# EAGLE board DIY_Keyboard_V1.1 (EAGLE 9.4.2)
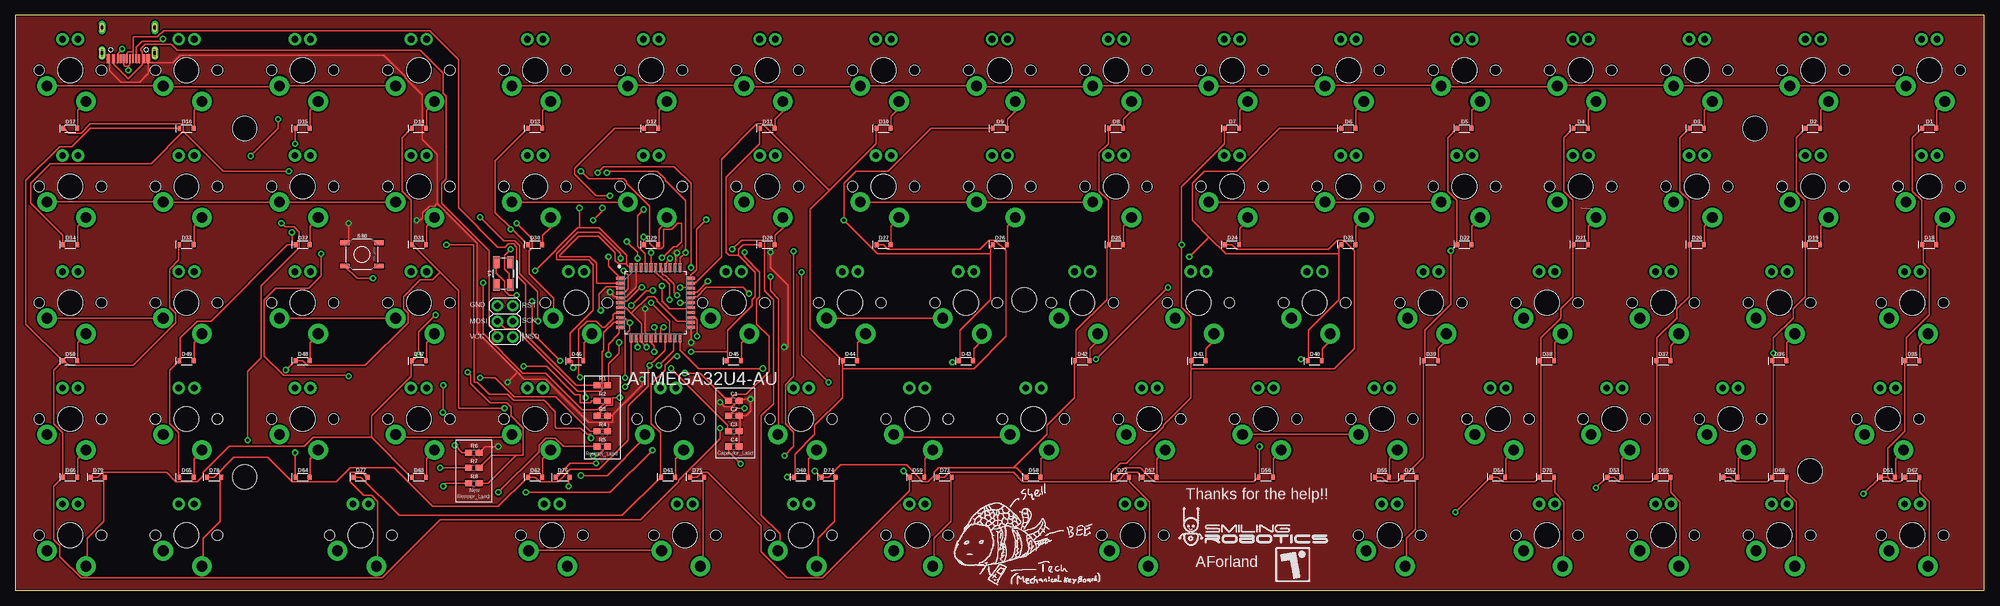
[diagram p2: board, top side]
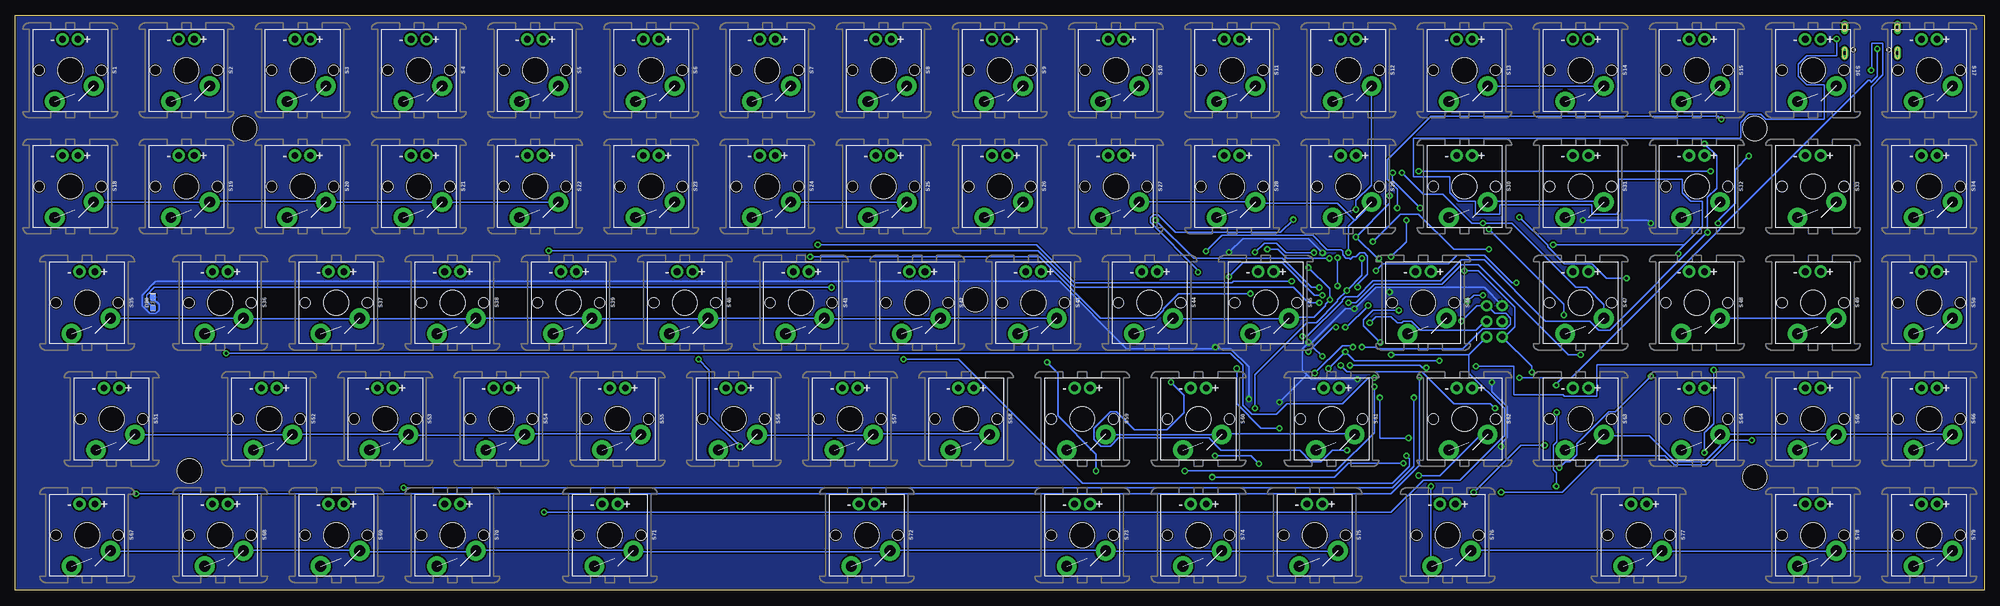
[diagram p3: board, bottom side, seen from below]

Size 322 x 94 mm. Coordinates in mm from the lower left corner, seen from the top.
Outline: 0,0 322,0 322,94 0,94 0,0
Copper layers (1*16): Top 0.035mm / dielectric 1.5mm / Bottom 0.035mm
Design rules "SparkFun-2-layer-STANDARD *": minimum track width 10mil, minimum drill 20mil, track to track 10mil, track to pad 6mil, pad to pad 6mil, via to via 10mil, smd to smd 8mil, copper to edge 8mil, drill to drill 8mil, minimum pad ring 10mil, minimum via ring 10mil, stop-mask expansion 4mil, vias tented up to drill 20mil, thermal gap 10mil
Holes 4 mm at 37.5,75.5 37.5,18.5 293.5,19.5 284.5,75.5 165,47.5

## Footprints (pad centres in the part's own frame; a part is rotated, then mirrored left to right if it is on the bottom)
QFP80P1200X1200X120-44N = smd 1.473 x 0.508: 1 -5.74,3.988; 2 -5.74,3.2; 3 -5.74,2.388; 4 -5.74,1.6; 5 -5.74,0.787; 6 -5.74,0; 7 -5.74,-0.787; 8 -5.74,-1.6; 9 -5.74,-2.388; 10 -5.74,-3.2; 11 -5.74,-3.988; 23 5.74,-3.988; 24 5.74,-3.2; 25 5.74,-2.388; 26 5.74,-1.6; 27 5.74,-0.787; 28 5.74,0; 29 5.74,0.787; 30 5.74,1.6; 31 5.74,2.388; 32 5.74,3.2; 33 5.74,3.988 | smd 0.508 x 1.473: 12 -3.988,-5.74; 13 -3.2,-5.74; 14 -2.388,-5.74; 15 -1.6,-5.74; 16 -0.787,-5.74; 17 0,-5.74; 18 0.787,-5.74; 19 1.6,-5.74; 20 2.388,-5.74; 21 3.2,-5.74; 22 3.988,-5.74; 34 3.988,5.74; 35 3.2,5.74; 36 2.388,5.74; 37 1.6,5.74; 38 0.787,5.74; 39 0,5.74; 40 -0.787,5.74; 41 -1.6,5.74; 42 -2.388,5.74; 43 -3.2,5.74; 44 -3.988,5.74
0603 = smd 1.1 x 1: 1 -0.85,0; 2 0.85,0
SOD-323 = smd 0.63 x 0.83: A 1.15,0; C -1.15,0
LED-0603 = smd 1 x 1: A -0.877,0; C 0.877,0
2X3 = drill 1.016 pad 1.88: 1 0,0; 2 0,2.54; 3 2.54,0; 4 2.54,2.54; 5 5.08,0; 6 5.08,2.54
CHERRY-MX-LED = drill 1.092 pad 2.032: A -1.27,-5.08; K 1.27,-5.08 | drill 1.753 pad 3.226: S1 -3.81,2.54; S2 2.54,5.08 | hole 4.089: 0,0 | hole 1.707: -5.08,0; 5.08,0
TACTILE_SWITCH_SMD_5.2MM = smd 1.524 x 0.762: 1 -2.794,1.905; 2 2.794,1.905; 3 -2.794,-1.905; 4 2.794,-1.905
USB_TYPE_C = smd 0.6 x 1.45: A1B12GND -3.25,5.095; A4B9VBUS -2.45,5.095; A9B4VBUS 2.45,5.095; A12B1GND 3.25,5.095 | smd 0.3 x 1.45: A5 -1.25,5.095; A6 -0.25,5.095; A7 0.25,5.095; A8 1.25,5.095; B5 1.75,5.095; B6 0.75,5.095; B7 -0.75,5.095; B8 -1.75,5.095 | drill 0.6 long: P$1 -4.32,0; P$2 4.32,0 | drill 0.6 pad 1 long: P$3 -4.32,4.18; P$4 4.32,4.18 | hole 0.65: -2.89,3.65; 2.89,3.65
CRYSTAL-SMD-5X3.2-4PAD = smd 1.9 x 1.1: 1 -1.85,-1.15; 2 1.85,-1.15; 3 1.85,1.15; 4 -1.85,1.15

## Placement (x,y rotation side)
ATMEGA32U4-AU  ATMEGA32U4-AU  [QFP80P1200X1200X120-44N]  104.73,47 0 top
C1  1.0uF  [0603]  117.5,31 0 top
C2  10pF  [0603]  117.5,28.5 0 top
C3  10pF  [0603]  117.5,26 0 top
C4  1.0uF  [0603]  117.5,23.5 0 top
D1  250mA/100V  [SOD-323]  313,75.5 0 top
D2  250mA/100V  [SOD-323]  294,75.5 0 top
D3  250mA/100V  [SOD-323]  275,75.5 0 top
D4  250mA/100V  [SOD-323]  256,75.5 0 top
D5  250mA/100V  [SOD-323]  237,75.5 0 top
D6  250mA/100V  [SOD-323]  218,75.5 0 top
D7  250mA/100V  [SOD-323]  199,75.5 0 top
D8  250mA/100V  [SOD-323]  180,75.5 0 top
D9  250mA/100V  [SOD-323]  161,75.5 0 top
D10  250mA/100V  [SOD-323]  142,75.5 0 top
D11  250mA/100V  [SOD-323]  123,75.5 0 top
D12  250mA/100V  [SOD-323]  104,75.5 0 top
D13  250mA/100V  [SOD-323]  85,75.5 0 top
D14  250mA/100V  [SOD-323]  66,75.5 0 top
D15  250mA/100V  [SOD-323]  47,75.5 0 top
D16  250mA/100V  [SOD-323]  28,75.5 0 top
D17  250mA/100V  [SOD-323]  9,75.5 0 top
D18  250mA/100V  [SOD-323]  313,56.5 0 top
D19  250mA/100V  [SOD-323]  294,56.5 0 top
D20  250mA/100V  [SOD-323]  275,56.5 0 top
D21  250mA/100V  [SOD-323]  256,56.5 0 top
D22  250mA/100V  [SOD-323]  237,56.5 0 top
D23  250mA/100V  [SOD-323]  218,56.5 0 top
D24  250mA/100V  [SOD-323]  199,56.5 0 top
D25  250mA/100V  [SOD-323]  180,56.5 0 top
D26  250mA/100V  [SOD-323]  161,56.5 0 top
D27  250mA/100V  [SOD-323]  142,56.5 0 top
D28  250mA/100V  [SOD-323]  123,56.5 0 top
D29  250mA/100V  [SOD-323]  104,56.5 0 top
D30  250mA/100V  [SOD-323]  85,56.5 0 top
D31  250mA/100V  [SOD-323]  66,56.5 0 top
D32  250mA/100V  [SOD-323]  47,56.5 0 top
D33  250mA/100V  [SOD-323]  28,56.5 0 top
D34  250mA/100V  [SOD-323]  9,56.5 0 top
D35  250mA/100V  [SOD-323]  310.25,37.5 0 top
D36  250mA/100V  [SOD-323]  288.5,37.5 0 top
D37  250mA/100V  [SOD-323]  269.5,37.5 0 top
D38  250mA/100V  [SOD-323]  250.5,37.5 0 top
D39  250mA/100V  [SOD-323]  231.5,37.5 0 top
D40  250mA/100V  [SOD-323]  212.5,37.5 0 top
D41  250mA/100V  [SOD-323]  193.5,37.5 0 top
D42  250mA/100V  [SOD-323]  174.5,37.5 0 top
D43  250mA/100V  [SOD-323]  155.5,37.5 0 top
D44  250mA/100V  [SOD-323]  136.5,37.5 0 top
D45  250mA/100V  [SOD-323]  117.5,37.5 0 top
D46  250mA/100V  [SOD-323]  91.75,37.5 0 top
D47  250mA/100V  [SOD-323]  66,37.5 0 top
D48  250mA/100V  [SOD-323]  47,37.5 0 top
D49  250mA/100V  [SOD-323]  28,37.5 0 top
D50  250mA/100V  [SOD-323]  9,37.5 0 top
D51  250mA/100V  [SOD-323]  306.25,18.5 0 top
D52  250mA/100V  [SOD-323]  280.5,18.5 0 top
D53  250mA/100V  [SOD-323]  261.5,18.5 0 top
D54  250mA/100V  [SOD-323]  242.5,18.5 0 top
D55  250mA/100V  [SOD-323]  223.5,18.5 0 top
D56  250mA/100V  [SOD-323]  204.5,18.5 0 top
D57  250mA/100V  [SOD-323]  185.5,18.5 0 top
D58  250mA/100V  [SOD-323]  166.5,18.5 0 top
D59  250mA/100V  [SOD-323]  147.5,18.5 0 top
D60  250mA/100V  [SOD-323]  128.5,18.5 0 top
D61  250mA/100V  [SOD-323]  106.75,18.5 0 top
D62  250mA/100V  [SOD-323]  85,18.5 0 top
D63  250mA/100V  [SOD-323]  66,18.5 0 top
D64  250mA/100V  [SOD-323]  47,18.5 0 top
D65  250mA/100V  [SOD-323]  28,18.5 0 top
D66  250mA/100V  [SOD-323]  9,18.5 0 top
D67  250mA/100V  [SOD-323]  310.25,18.5 0 top
D68  250mA/100V  [SOD-323]  288.5,18.5 0 top
D69  250mA/100V  [SOD-323]  269.5,18.5 0 top
D70  250mA/100V  [SOD-323]  250.5,18.5 0 top
D71  250mA/100V  [SOD-323]  228,18.5 0 top
D72  250mA/100V  [SOD-323]  181,18.5 0 top
D73  250mA/100V  [SOD-323]  152,18.5 0 top
D74  250mA/100V  [SOD-323]  133,18.5 0 top
D75  250mA/100V  [SOD-323]  111.5,18.5 0 top
D76  250mA/100V  [SOD-323]  89.5,18.5 0 top
D77  250mA/100V  [SOD-323]  56.5,18.5 0 top
D78  250mA/100V  [SOD-323]  32.5,18.5 0 top
D79  250mA/100V  [SOD-323]  13.5,18.5 0 top
D80  WHITE  [LED-0603]  299.5,47 90 bottom
ISP  [2X3]  81.39,41.43 90 top
R1  22  [0603]  96,33.5 0 top
R2  22  [0603]  96,31 0 top
R3  5.1k  [0603]  96,28.5 0 top
R4  5.1k  [0603]  96,26 0 top
R5  22  [0603]  96,23.5 0 top
R6  1k  [0603]  75,22.5 0 top
R7  56k  [0603]  75,20 0 top
R8  56k  [0603]  75,17.5 0 top
S1  MOMENTARY-SWITCH-SPST-LED-PTH-CHERRY  [CHERRY-MX-LED]  313,85 180 bottom
S2  MOMENTARY-SWITCH-SPST-LED-PTH-CHERRY  [CHERRY-MX-LED]  294,85 180 bottom
S3  MOMENTARY-SWITCH-SPST-LED-PTH-CHERRY  [CHERRY-MX-LED]  275,85 180 bottom
S4  MOMENTARY-SWITCH-SPST-LED-PTH-CHERRY  [CHERRY-MX-LED]  256,85 180 bottom
S5  MOMENTARY-SWITCH-SPST-LED-PTH-CHERRY  [CHERRY-MX-LED]  237,85 180 bottom
S6  MOMENTARY-SWITCH-SPST-LED-PTH-CHERRY  [CHERRY-MX-LED]  218,85 180 bottom
S7  MOMENTARY-SWITCH-SPST-LED-PTH-CHERRY  [CHERRY-MX-LED]  199,85 180 bottom
S8  MOMENTARY-SWITCH-SPST-LED-PTH-CHERRY  [CHERRY-MX-LED]  180,85 180 bottom
S9  MOMENTARY-SWITCH-SPST-LED-PTH-CHERRY  [CHERRY-MX-LED]  161,85 180 bottom
S10  MOMENTARY-SWITCH-SPST-LED-PTH-CHERRY  [CHERRY-MX-LED]  142,85 180 bottom
S11  MOMENTARY-SWITCH-SPST-LED-PTH-CHERRY  [CHERRY-MX-LED]  123,85 180 bottom
S12  MOMENTARY-SWITCH-SPST-LED-PTH-CHERRY  [CHERRY-MX-LED]  104,85 180 bottom
S13  MOMENTARY-SWITCH-SPST-LED-PTH-CHERRY  [CHERRY-MX-LED]  85,85 180 bottom
S14  MOMENTARY-SWITCH-SPST-LED-PTH-CHERRY  [CHERRY-MX-LED]  66,85 180 bottom
S15  MOMENTARY-SWITCH-SPST-LED-PTH-CHERRY  [CHERRY-MX-LED]  47,85 180 bottom
S16  MOMENTARY-SWITCH-SPST-LED-PTH-CHERRY  [CHERRY-MX-LED]  28,85 180 bottom
S17  MOMENTARY-SWITCH-SPST-LED-PTH-CHERRY  [CHERRY-MX-LED]  9,85 180 bottom
S18  MOMENTARY-SWITCH-SPST-LED-PTH-CHERRY  [CHERRY-MX-LED]  313,66 180 bottom
S19  MOMENTARY-SWITCH-SPST-LED-PTH-CHERRY  [CHERRY-MX-LED]  294,66 180 bottom
S20  MOMENTARY-SWITCH-SPST-LED-PTH-CHERRY  [CHERRY-MX-LED]  275,66 180 bottom
S21  MOMENTARY-SWITCH-SPST-LED-PTH-CHERRY  [CHERRY-MX-LED]  256,66 180 bottom
S22  MOMENTARY-SWITCH-SPST-LED-PTH-CHERRY  [CHERRY-MX-LED]  237,66 180 bottom
S23  MOMENTARY-SWITCH-SPST-LED-PTH-CHERRY  [CHERRY-MX-LED]  218,66 180 bottom
S24  MOMENTARY-SWITCH-SPST-LED-PTH-CHERRY  [CHERRY-MX-LED]  199,66 180 bottom
S25  MOMENTARY-SWITCH-SPST-LED-PTH-CHERRY  [CHERRY-MX-LED]  180,66 180 bottom
S26  MOMENTARY-SWITCH-SPST-LED-PTH-CHERRY  [CHERRY-MX-LED]  161,66 180 bottom
S27  MOMENTARY-SWITCH-SPST-LED-PTH-CHERRY  [CHERRY-MX-LED]  142,66 180 bottom
S28  MOMENTARY-SWITCH-SPST-LED-PTH-CHERRY  [CHERRY-MX-LED]  123,66 180 bottom
S29  MOMENTARY-SWITCH-SPST-LED-PTH-CHERRY  [CHERRY-MX-LED]  104,66 180 bottom
S30  MOMENTARY-SWITCH-SPST-LED-PTH-CHERRY  [CHERRY-MX-LED]  85,66 180 bottom
S31  MOMENTARY-SWITCH-SPST-LED-PTH-CHERRY  [CHERRY-MX-LED]  66,66 180 bottom
S32  MOMENTARY-SWITCH-SPST-LED-PTH-CHERRY  [CHERRY-MX-LED]  47,66 180 bottom
S33  MOMENTARY-SWITCH-SPST-LED-PTH-CHERRY  [CHERRY-MX-LED]  28,66 180 bottom
S34  MOMENTARY-SWITCH-SPST-LED-PTH-CHERRY  [CHERRY-MX-LED]  9,66 180 bottom
S35  MOMENTARY-SWITCH-SPST-LED-PTH-CHERRY  [CHERRY-MX-LED]  310.25,47 180 bottom
S36  MOMENTARY-SWITCH-SPST-LED-PTH-CHERRY  [CHERRY-MX-LED]  288.5,47 180 bottom
S37  MOMENTARY-SWITCH-SPST-LED-PTH-CHERRY  [CHERRY-MX-LED]  269.5,47 180 bottom
S38  MOMENTARY-SWITCH-SPST-LED-PTH-CHERRY  [CHERRY-MX-LED]  250.5,47 180 bottom
S39  MOMENTARY-SWITCH-SPST-LED-PTH-CHERRY  [CHERRY-MX-LED]  231.5,47 180 bottom
S40  MOMENTARY-SWITCH-SPST-LED-PTH-CHERRY  [CHERRY-MX-LED]  212.5,47 180 bottom
S41  MOMENTARY-SWITCH-SPST-LED-PTH-CHERRY  [CHERRY-MX-LED]  193.5,47 180 bottom
S42  MOMENTARY-SWITCH-SPST-LED-PTH-CHERRY  [CHERRY-MX-LED]  174.5,47 180 bottom
S43  MOMENTARY-SWITCH-SPST-LED-PTH-CHERRY  [CHERRY-MX-LED]  155.5,47 180 bottom
S44  MOMENTARY-SWITCH-SPST-LED-PTH-CHERRY  [CHERRY-MX-LED]  136.5,47 180 bottom
S45  MOMENTARY-SWITCH-SPST-LED-PTH-CHERRY  [CHERRY-MX-LED]  117.5,47 180 bottom
S46  MOMENTARY-SWITCH-SPST-LED-PTH-CHERRY  [CHERRY-MX-LED]  91.75,47 180 bottom
S47  MOMENTARY-SWITCH-SPST-LED-PTH-CHERRY  [CHERRY-MX-LED]  66,47 180 bottom
S48  MOMENTARY-SWITCH-SPST-LED-PTH-CHERRY  [CHERRY-MX-LED]  47,47 180 bottom
S49  MOMENTARY-SWITCH-SPST-LED-PTH-CHERRY  [CHERRY-MX-LED]  28,47 180 bottom
S50  MOMENTARY-SWITCH-SPST-LED-PTH-CHERRY  [CHERRY-MX-LED]  9,47 180 bottom
S51  MOMENTARY-SWITCH-SPST-LED-PTH-CHERRY  [CHERRY-MX-LED]  306.25,28 180 bottom
S52  MOMENTARY-SWITCH-SPST-LED-PTH-CHERRY  [CHERRY-MX-LED]  280.5,28 180 bottom
S53  MOMENTARY-SWITCH-SPST-LED-PTH-CHERRY  [CHERRY-MX-LED]  261.5,28 180 bottom
S54  MOMENTARY-SWITCH-SPST-LED-PTH-CHERRY  [CHERRY-MX-LED]  242.5,28 180 bottom
S55  MOMENTARY-SWITCH-SPST-LED-PTH-CHERRY  [CHERRY-MX-LED]  223.5,28 180 bottom
S56  MOMENTARY-SWITCH-SPST-LED-PTH-CHERRY  [CHERRY-MX-LED]  204.5,28 180 bottom
S57  MOMENTARY-SWITCH-SPST-LED-PTH-CHERRY  [CHERRY-MX-LED]  185.5,28 180 bottom
S58  MOMENTARY-SWITCH-SPST-LED-PTH-CHERRY  [CHERRY-MX-LED]  166.5,28 180 bottom
S59  MOMENTARY-SWITCH-SPST-LED-PTH-CHERRY  [CHERRY-MX-LED]  147.5,28 180 bottom
S60  MOMENTARY-SWITCH-SPST-LED-PTH-CHERRY  [CHERRY-MX-LED]  128.5,28 180 bottom
S61  MOMENTARY-SWITCH-SPST-LED-PTH-CHERRY  [CHERRY-MX-LED]  106.75,28 180 bottom
S62  MOMENTARY-SWITCH-SPST-LED-PTH-CHERRY  [CHERRY-MX-LED]  85,28 180 bottom
S63  MOMENTARY-SWITCH-SPST-LED-PTH-CHERRY  [CHERRY-MX-LED]  66,28 180 bottom
S64  MOMENTARY-SWITCH-SPST-LED-PTH-CHERRY  [CHERRY-MX-LED]  47,28 180 bottom
S65  MOMENTARY-SWITCH-SPST-LED-PTH-CHERRY  [CHERRY-MX-LED]  28,28 180 bottom
S66  MOMENTARY-SWITCH-SPST-LED-PTH-CHERRY  [CHERRY-MX-LED]  9,28 180 bottom
S67  MOMENTARY-SWITCH-SPST-LED-PTH-CHERRY  [CHERRY-MX-LED]  310.25,9 180 bottom
S68  MOMENTARY-SWITCH-SPST-LED-PTH-CHERRY  [CHERRY-MX-LED]  288.5,9 180 bottom
S69  MOMENTARY-SWITCH-SPST-LED-PTH-CHERRY  [CHERRY-MX-LED]  269.5,9 180 bottom
S70  MOMENTARY-SWITCH-SPST-LED-PTH-CHERRY  [CHERRY-MX-LED]  250.5,9 180 bottom
S71  MOMENTARY-SWITCH-SPST-LED-PTH-CHERRY  [CHERRY-MX-LED]  224.75,9 180 bottom
S72  MOMENTARY-SWITCH-SPST-LED-PTH-CHERRY  [CHERRY-MX-LED]  182.75,9 180 bottom
S73  MOMENTARY-SWITCH-SPST-LED-PTH-CHERRY  [CHERRY-MX-LED]  147.5,9 180 bottom
S74  MOMENTARY-SWITCH-SPST-LED-PTH-CHERRY  [CHERRY-MX-LED]  128.5,9 180 bottom
S75  MOMENTARY-SWITCH-SPST-LED-PTH-CHERRY  [CHERRY-MX-LED]  109.5,9 180 bottom
S76  MOMENTARY-SWITCH-SPST-LED-PTH-CHERRY  [CHERRY-MX-LED]  87.75,9 180 bottom
S77  MOMENTARY-SWITCH-SPST-LED-PTH-CHERRY  [CHERRY-MX-LED]  56.5,9 180 bottom
S78  MOMENTARY-SWITCH-SPST-LED-PTH-CHERRY  [CHERRY-MX-LED]  28,9 180 bottom
S79  MOMENTARY-SWITCH-SPST-LED-PTH-CHERRY  [CHERRY-MX-LED]  9,9 180 bottom
S80  MOMENTARY-SWITCH-SPST-SMD-5.2MM  [TACTILE_SWITCH_SMD_5.2MM]  56.69,54.9 0 top
U$1  USB_TYPE_C  [USB_TYPE_C]  18.5,92 180 top
Y1  16MHz  [CRYSTAL-SMD-5X3.2-4PAD]  79.82,51.78 90 top

## Tracks (layer width: path | path; a pad name or v marks a point on that pad's centre or on a via)
C1  (via drill 0.51)
  Top 0.254: D1.C 311.75,75.5 310.25,74 310.25,65.25 311.75,63.75 311.75,56.5 D18.C 312,56.5 312,53.5 313,52.5 313,45 309.25,41.25 309.25,37.5 D35.C 309,37.5 309,26 306.25,23.25 306.25,18.5 | 306.25,18.5 D51.C 305,18.5 v302.25,15.75 | 306.25,18.5 307,17.75 308.25,17.75 309,18.5 D67.C | v92.35,34.8 92.15,35 92.15,42.65 93.5,44 95,44 96,43 96.38,43 97.75,44.37 97.75,45 98,45.25 98.64,45.25 98.79,45.4 ATMEGA32U4-AU.8
  Bottom 0.254: v92.35,34.8 92.35,20.4 97,15.75 v302.25,15.75
C2  (via drill 0.51)
  Top 0.254: ATMEGA32U4-AU.9 98.99,44.5 99.75,44.5 v100.5,43.75 100.5,42.5 99.75,41.75 v99.75,34.75 | 292.75,56.5 292.75,63.75 291.25,65.25 291.25,74 292.75,75.5 D2.C | D52.C 280.5,18.5 281.25,17.75 286.5,17.75 287.25,18.5 D68.C 287.5,18.5 287.5,37.5 | 292.75,56.5 292.75,48 290.75,46 290.75,44.5 287.5,41.25 v287.5,38.75 287.5,37.5 | 292.75,56.5 D19.C | 287.5,37.5 D36.C
  Bottom 0.254: v100.5,43.75 99.5,44.75 97,44.75 96,43.75 95.25,43.75 95,44 93.69,44 92.19,42.5 83.16,42.5 81.69,43.97 ISP.3 | v99.75,34.75 100.75,34.75 105,30.5 114,30.5 115.75,28.75 119.75,28.75 121.25,30.25 121.25,36.75 123.25,38.75 v287.5,38.75
C3  (via drill 0.51)
  Top 0.254: 93.25,32.5 92,32.5 82.75,41.75 82.75,42 82,42.75 80.07,42.75 ISP.4 | 93.25,32.5 95.75,32.5 96,32.75 96,39 96.25,39.25 96.25,42.15 97.9,43.8 ATMEGA32U4-AU.10 | 273.75,56.5 273.75,63.75 272.25,65.25 272.25,74 273.75,75.5 D3.C | 273.75,56.5 D20.C 273.75,56.5 | 268.5,37.5 268.5,18.5 D69.C 268.25,18.5 267.5,17.75 262.25,17.75 261.5,18.5 260.5,18.5 D53.C 260.25,18.5 v258.5,16.75 | 268.5,37.5 D37.C 268.5,37.5 | 273.75,56.5 273.75,48 271.75,46 271.75,44.5 268.5,41.25 268.5,37.5 | v93.25,31.5 93.25,32.5
  Bottom 0.254: v93.25,31.5 93.25,20.25 96.75,16.75 v258.5,16.75
C4  (via drill 0.51)
  Top 0.254: v97,38.5 97,40.25 98.75,42 98.75,43.01 ATMEGA32U4-AU.11 | 254.75,56.5 254.75,63.75 253.25,65.25 253.25,74 254.75,75.5 D4.C | 254.75,56.5 D21.C 254.75,56.5 | 249.5,37.5 249.5,18.5 D70.C 249.25,18.5 248.5,17.75 243.25,17.75 242.5,18.5 241.5,18.5 D54.C 241.25,18.5 v235.5,12.75 | 249.5,37.5 D38.C 249.5,37.5 | 254.75,56.5 254.75,48 252.75,46 252.75,44.5 249.5,41.25 249.5,37.5
  Bottom 0.254: 84.25,38.5 v97,38.5 | 84.25,38.5 81.39,41.36 ISP.1 | 84.25,38.5 84.25,35.5 78.5,29.75 78.5,25.25 85.75,18 91.75,18 97,12.75 v235.5,12.75
C5  (via drill 0.51)
  Top 0.254: D55.C 222.5,18.5 223.5,18.5 224.25,17.75 226,17.75 226.75,18.5 D71.C 227,18.5 230.25,21.75 230.25,37.5 D39.C 230.5,37.5 230.5,42.5 234.75,46.75 v234.75,55.5 235.75,56.5 | 235.75,56.5 235.75,63.75 234.25,65.25 234.25,74 235.75,75.5 D5.C | 235.75,56.5 D22.C 235.75,56.5 | v108.75,47 110.25,47 ATMEGA32U4-AU.28
  Bottom 0.254: v108.75,47 110.5,47 113,49.5 148.75,49.5 154.75,55.5 v234.75,55.5
C6  (via drill 0.51)
  Top 0.254: D72.C 180,18.5 181.5,20 184,20 186.25,17.75 202.5,17.75 203.25,18.5 D56.C 203.5,18.5 v203.5,23.5 | 211.5,37.75 211.5,37.5 D40.C | 216.5,55 216.5,56.25 216.75,56.5 D23.C | 216.5,55 216.5,47.5 211.5,42.5 211.5,39.08 211.5,37.75 | 195.25,57.75 198,55 216.5,55 | 195.25,57.75 192.5,60.5 192.5,66.5 194.5,68.5 199.75,68.5 206.75,75.5 216.75,75.5 D6.C | v120,48.5 119,49.5 113,49.5 111.5,48 110.47,48 ATMEGA32U4-AU.29 | 195.25,57.75 v192,54.5 | 211.5,37.75 v210.25,37.75
  Bottom 0.254: v120,48.5 131.75,48.5 134.25,46 134.25,45.75 135.5,44.5 144.5,44.5 154.5,54.5 v192,54.5 | v203.5,23.5 208.5,28.5 208.5,36 v210.25,37.75
C7  (via drill 0.51)
  Top 0.254: 179.25,17.75 180.25,17.75 181.75,19.25 183.5,19.25 184.25,18.5 D57.C | 179.25,17.75 164.75,17.75 163.25,19.25 152.75,19.25 152,18.5 151,18.5 D73.C | 192.25,36.25 192.25,36.75 192.25,37.5 | 179.25,17.75 179.25,19.25 180.75,20.75 181.75,20.75 187.75,26.75 187.75,27 192.25,31.5 192.25,36.25 | 192.25,37.5 D41.C 192.25,37.5 | 192.25,36.25 215.75,36.25 219,39.5 219,55.5 217.25,57.25 216.25,57.25 214.75,55.75 199.75,55.75 199,56.5 198,56.5 D24.C | 192.25,37.5 192.25,44.75 190.75,46.25 v190.75,56.5 190.75,66 197.75,73 197.75,75.5 D7.C | v113.25,50.5 111.5,48.75 110.47,48.75 ATMEGA32U4-AU.30
  Bottom 0.254: v113.25,50.5 122.75,50.5 123,50.25 148.75,50.25 155,56.5 v190.75,56.5
C8  (via drill 0.51)
  Top 0.254: 178.75,56.5 178.5,56.25 178.5,47.5 173.5,42.5 173.5,37.5 D42.C 173.25,37.5 173.25,31.5 168.75,27 168.75,25.5 163.25,20 | 178.75,56.5 D25.C 178.75,56.5 | 178.75,56.5 178.75,63.75 177.25,65.25 177.25,71.5 178.75,73 178.75,75.5 D8.C | 163.25,20 163.75,20 165.25,18.5 D58.C | 163.25,20 151,20 150.25,19.25 150.25,18.75 149.25,17.75 148.25,17.75 148,18 148,18.25 145.75,20.5 135,20.5 133,18.5 132,18.5 D74.C 131.75,18.5 v130.75,19.5 | ATMEGA32U4-AU.12 100.74,34.24 v99.75,33.25
  Bottom 0.254: v99.75,33.25 99.75,25.75 106,19.5 v130.75,19.5
C9  (via drill 0.51)
  Top 0.254: 146.25,18.5 146.25,16.25 132,2 126.25,2 122,6.25 122,10.5 113.25,19.25 112.25,19.25 111.5,18.5 110.5,18.5 D75.C | 146.25,18.5 D59.C 146.25,18.5 | 159.5,55 159.5,56.25 159.75,56.5 D26.C | 159.5,55 159.5,47.5 154.5,42.5 154.5,37.5 D43.C 154.25,37.5 154,37.25 v153.25,37.25 | 159.5,55 141,55 v135.5,60.5 135.5,66.5 137.5,68.5 142.75,68.5 149.75,75.5 159.75,75.5 D9.C | v108.75,49.5 110.47,49.5 ATMEGA32U4-AU.31 | v145.25,19.5 146.25,18.5
  Bottom 0.254: v108.75,49.5 110,49.5 114.75,54.25 129.25,54.25 v135.5,60.5 | v145.25,19.5 145.25,22.25 151.5,28.5 151.5,35.5 v153.25,37.25
C10  (via drill 0.51)
  Top 0.254: v95,20.75 90.75,20.75 88.5,18.5 D76.C | v126.25,18.5 127.25,18.5 D60.C 127.5,18.5 127.5,22.25 130.75,25.5 130.75,27 135.25,31.5 135.25,36.25 | 135.25,36.25 135.25,37.5 | 135.25,37.5 D44.C 135.25,37.5 | 135.25,36.25 156.75,36.25 162,41.5 162,55.5 160.25,57.25 159.25,57.25 157.75,55.75 142.75,55.75 142,56.5 141,56.5 D27.C | 133.25,65.5 130,62.25 130,42.75 135.25,37.5 | 133.25,65.5 140.75,73 140.75,75.5 D10.C | 133.25,65.5 133,65.5 122.25,76.25 121.25,76.25 115.5,70.5 115.5,54.5 111.25,50.25 110.47,50.25 ATMEGA32U4-AU.32
  Bottom 0.254: v95,20.75 104,20.75 106.25,18.5 v126.25,18.5
C11  (via drill 0.51)
  Top 0.254: D77.C 56.5,18.5 62.75,12.25 99.25,12.25 105.5,18.5 | 116.5,39 116.5,42.5 120.5,46.5 120.5,47.5 121,48 121,52 118.25,54.75 | 116.5,39 116.5,37.5 D45.C | 118.25,54.75 118.25,55.75 119,56.5 D28.C | 118.25,54.75 116.75,54.75 116.25,55.25 116.25,67.5 121.75,73 121.75,75.5 D11.C | 116.5,39 v110.5,39 | v106,43 105.52,43 ATMEGA32U4-AU.18 | 105.5,18.5 105.5,25.75 104,27.25 104,33.75 106.25,36 106.25,36.75 107.75,38.25 v108.25,38.25 | 105.5,18.5 D61.C
  Bottom 0.254: v106,43 106.5,43 109.75,39.75 | v110.5,39 109.75,39.75 | 109.75,39.75 v108.25,38.25
C12  (via drill 0.51)
  Top 0.254: D78.C 32.5,18.5 35.75,21.75 41.25,21.75 45.25,17.75 52.5,17.75 54.75,20 62,20 68.25,13.75 79,13.75 83.75,18.5 D62.C 85,18.5 85.75,17.75 88.75,17.75 90.75,19.75 95.5,19.75 100.25,24.5 100.25,30.15 103.45,33.35 103.45,36.45 v103.75,36.75 106.25,39.25 106.25,41.26 ATMEGA32U4-AU.19 | v91.25,36.35 91.25,36.45 91.15,36.55 91.15,37.5 90.75,37.5 | v102.75,57.75 102.75,56.5 D29.C | 90.75,37.5 90.75,42 94.5,45.75 94.5,53.25 93.75,54 88.5,54 88.5,55 92,58.5 95.5,58.5 99,55 v99,54.25 | 90.75,37.5 D46.C | D12.C 98,75.5 91.5,69 91.5,68 95,64.5 v97.25,64.5
  Bottom 0.254: v91.25,36.35 91.85,36.35 92.25,36.75 v103.75,36.75 | v99,54.25 99.25,54.25 v102.75,57.75 97.25,63.25 v97.25,64.5
C13  (via drill 0.51)
  Top 0.254: 81,59.25 78.5,61.75 78.5,70.25 83.75,75.5 D13.C | 81,59.25 83.75,56.5 D30.C | D79.C 13.5,18.5 14.25,19.25 24.75,19.25 26.25,17.75 29.75,17.75 30.75,18.75 30.75,19.25 35,23.5 47.25,23.5 48.75,25 58.25,25 | 58.25,25 64.75,18.5 D63.C | 58.25,25 58.25,28.5 64.75,35 64.75,37.5 D47.C 65,37.5 v66,38.5 66,42.25 v68.75,45 | v104,47 107,44 107,41.26 ATMEGA32U4-AU.20 | v81,59 81,59.25
  Bottom 0.254: v104,47 102.75,47 99.7,50.05 88.7,50.05 85.5,53.25 82.75,53.25 68,38.5 v66,38.5 | v81,59 68.75,46.75 v68.75,45
C14  (via drill 0.51)
  Top 0.254: v45.75,22.5 45.75,18.5 D64.C | v44.25,36 45.75,37.5 D48.C 46,37.5 47,37.5 47.75,36.75 57.25,36.75 64.25,43.75 64.25,45.25 63.5,46 63.5,48 66.25,50.75 68.25,50.75 69.5,52 | D14.C 64.75,75.5 63.25,74 63.25,65.25 64.75,63.75 64.75,56.5 D31.C 65,56.5 69.5,52 | v105.25,36.75 107.65,39.15 107.65,41.26 ATMEGA32U4-AU.21 | v80,29.75 72.5,29.75 72.5,49 69.5,52
  Bottom 0.254: v45.75,22.5 45.75,25.75 44.25,27.25 v44.25,36 | v105.25,36.75 104.25,35.75 92,35.75 86.75,30.5 80.75,30.5 v80,29.75
C15  (via drill 0.51)
  Top 0.254: D65.C 26.75,18.5 26.75,25.75 25.25,27.25 25.25,36 26.75,37.5 D49.C 27,37.5 27,41.25 29.75,44 32,44 44.5,56.5 45.25,56.5 | 45.25,56.5 D32.C | v45.75,73 45.75,75.5 D15.C | 45.25,56.5 v45.25,58.5 | v111.5,41.5 111.5,44.25 111.15,44.6 ATMEGA32U4-AU.25
  Bottom 0.254: v45.75,73 43.75,71 43.75,65.75 45.25,64.25 v45.25,58.5 61.25,42.5 63,42.5 64.5,44 71.75,44 81.75,54 85.5,54 88.94,50.56 99.94,50.56 102.5,48 104.5,48 105,47.5 105,47.25 110.75,41.5 v111.5,41.5
C16  (via drill 0.51)
  Top 0.254: 7.75,18.5 7.75,25.75 6.25,27.25 6.25,36 7.75,37.5 | 7.75,18.5 D66.C 7.75,18.5 | 7.75,37.5 D50.C | D33.C 26.75,56.5 26.75,54 25.25,52.5 25.25,46.25 26.25,45.25 26.25,43.75 19.25,36.75 8.75,36.75 8,37.5 D50.C | 7.75,37.5 1.75,43.5 1.75,67 7.25,72.5 9.25,72.5 12.25,75.5 26.75,75.5 D16.C | 7.75,37.5 D50.C | v122.25,36.25 111.75,36.25 108.75,39.25 108.75,41.26 ATMEGA32U4-AU.22 | v115.25,26.5 115.25,24.75 108.5,18 108.5,17.75 102.25,11.5 69.5,11.5 60,2 10.75,2 7.25,5.5 7.25,7.25 6.25,8.25 6.25,17 7.75,18.5
  Bottom 0.254: v122.25,36.25 122.25,30.5 118.25,26.5 v115.25,26.5
C17  (via drill 0.51)
  Top 0.254: 27.5,75 22.25,69.75 5.75,69.75 2.5,66.5 2.5,63.25 7.75,58 7.75,56.5 D34.C | 27.5,75 27.5,76 27.25,76.25 12.25,76.25 10.75,74.75 8.75,74.75 8,75.5 D17.C | v105.75,49.75 105.75,47.25 107,46 110.47,46 ATMEGA32U4-AU.27 | v92.5,68.5 93.75,67.25 99.5,67.25 100,66.75 100,66.5 103.75,62.75 103.75,56.75 104.69,55.81 105.58,55.81 106,56.23 106,59 106.03,59.03 107.32,59.03 108.3,60 108.99,60 108.99,57 108.13,56.14 107.63,56.14 105.84,54.35 v105.75,54.35 | v44.75,68.5 34,68.5 27.5,75
  Bottom 0.254: v105.75,54.35 v105.75,49.75 | v44.75,68.5 v92.5,68.5
GND  (via drill 0.51)
  Top 0.254: 98.99,48 100,48 101.5,49.5 101.5,52.74 ATMEGA32U4-AU.43 | 98.99,48 ATMEGA32U4-AU.5 | 15.25,86.25 U$1.A12B1GND 15.47,86.68 15.47,84.92 17.31,83.07 20.31,83.07 21.74,84.5 21.74,85.49 21.75,85.5 21.75,86.25 | 21.75,86.25 U$1.A1B12GND 21.75,86.75 | 97.7,28.5 97.7,28.7 102.5,33.5 v102.5,34.5 | 97.7,28.5 97.7,27.5 97,27.5 | 97,27.5 97,26 R4.2 | v110.5,40.5 110.5,43.01 ATMEGA32U4-AU.23 | 97,28.5 R3.2 97.7,28.5 | 21.75,86.25 25.75,86.25 27,87.5 60.25,87.5 63.75,84 63.75,83.75 66.5,81 66.5,73.75 69,71.25 69,63.25 | 69,63.25 75.5,56.75 75.5,42.25 82.12,35.62 | 82.12,35.62 83.25,34.5 86.75,34.5 93.75,27.5 97,27.5 | v97.25,48.75 98,48 98.99,48 | 118.5,28.5 118.5,26 C3.2 C4.2 | v108.2,55.15 108,54.95 108,52.74 ATMEGA32U4-AU.35 | v123.5,55.25 123.5,52.75 126.35,49.9 126.35,39.75 v125.75,39.75 | 118.5,28.5 119.5,28.5 120.25,29.25 v120.25,31.25 118.75,31.25 118.5,31 C1.2 118.25,31 117.25,30 116,30 v115.25,30.75 | 118.5,28.5 C2.2 | v103,46 103,41.39 ATMEGA32U4-AU.15 | 82.12,35.62 v80.5,34 | v79,23.5 76.85,23.5 R6.2 | v65.64,60.5 66.25,60.5 66.65,60.9 66.65,61.7 67.76,62.81 68.56,62.81 69,63.25 | v54.5,60 54.5,57.41 S80.1
  Bottom 0.254: 97.25,49.5 81.75,49.5 78.85,46.6 ISP.6 | 97.25,49.5 99.5,49.5 v103,46 104.5,46 110,40.5 v110.5,40.5 111.5,39.5 111.5,36 110.75,35.25 | v102.5,34.5 110,34.5 110.75,35.25 | 97.25,49.5 v97.25,48.75 | 125.75,39.5 123.25,39.5 120.25,36.5 v120.25,31.25 | 125.75,39.5 140.25,39.5 151.25,50.5 299,50.5 301.25,48.25 301.25,46.5 300,45.25 299,45.25 298.5,45.75 298.5,46.75 299.5,47.75 D80.C | v108.2,55.15 110.55,57.5 121.25,57.5 v123.5,55.25 | 125.75,39.5 v125.75,39.75 | v115.25,30.75 110.75,35.25 | v80.5,34 80.5,32.47 77.99,29.96 77.99,25.04 79,24.03 v79,23.5 | v65.64,60.5 55,60.5 v54.5,60
  pour Top (isolate 0.012): 0,94 322,94 322,0 0,0
  pour Bottom (isolate 0.012): 0,94 0,0 322,0 322,94
N$1
  Top 0.254: D1.A 314.25,75.5 314.25,78.5 315.54,79.79 S1.S2
N$2
  Top 0.254: D2.A 295.25,75.5 295.25,78.5 296.54,79.79 S2.S2
N$3
  Top 0.254: D3.A 276.25,75.5 276.25,78.5 277.54,79.79 S3.S2
N$4
  Top 0.254: D4.A 257.25,75.5 257.25,78.5 258.54,79.79 S4.S2
N$5
  Top 0.254: D5.A 238.25,75.5 238.25,78.5 239.54,79.79 S5.S2
N$6
  Top 0.254: D6.A 219.25,75.5 219.25,78.5 220.54,79.79 S6.S2
N$7
  Top 0.254: D7.A 200.25,75.5 200.25,78.5 201.54,79.79 S7.S2
N$8
  Top 0.254: D8.A 181.25,75.5 181.25,77 182.54,78.29 S8.S2
N$9
  Top 0.254: D9.A 162.25,75.5 162.25,77 163.54,78.29 S9.S2
N$10
  Top 0.254: D10.A 143.25,75.5 143.25,77.5 144.54,78.79 S10.S2
N$11
  Top 0.254: D11.A 124.25,75.5 124.25,77 125.54,78.29 S11.S2
N$12
  Top 0.254: D12.A 105.25,75.5 105.25,78.5 106.54,79.79 S12.S2
N$13
  Top 0.254: D13.A 86.25,75.5 86.25,78.5 87.54,79.79 S13.S2
N$14
  Top 0.254: D14.A 67.25,75.5 67.25,78.5 68.54,79.79 S14.S2
N$15
  Top 0.254: D15.A 48.25,75.5 48.25,78.5 49.54,79.79 S15.S2
N$16
  Top 0.254: D16.A 29.25,75.5 29.25,78.5 30.54,79.79 S16.S2
N$17
  Top 0.254: D17.A 10.25,75.5 10.25,78.5 11.54,79.79 S17.S2
N$18
  Top 0.254: D18.A 314.25,56.5 314.25,59.5 315.54,60.79 S18.S2
N$19
  Top 0.254: D19.A 295.25,56.5 295.25,59.5 296.54,60.79 S19.S2
N$20
  Top 0.254: D20.A 276.25,56.5 276.25,59.5 277.54,60.79 S20.S2
N$21
  Top 0.254: D21.A 257.25,56.5 257.25,59.5 258.54,60.79 S21.S2
N$22
  Top 0.254: D22.A 238.25,56.5 238.25,59.5 239.54,60.79 S22.S2
N$23
  Top 0.254: D23.A 219.25,56.5 219.25,59.5 220.54,60.79 S23.S2
N$24
  Top 0.254: D24.A 200.25,56.5 200.25,59.2 201.54,60.49 S24.S2
N$25
  Top 0.254: D25.A 181.25,56.5 181.25,59.5 182.54,60.79 S25.S2
N$26
  Top 0.254: D26.A 162.25,56.5 162.25,59.5 163.54,60.79 S26.S2
N$27
  Top 0.254: D27.A 143.25,56.5 143.25,59.5 144.54,60.79 S27.S2
N$28
  Top 0.254: D28.A 124.25,56.5 124.25,58 125.54,59.29 S28.S2
N$29
  Top 0.254: D29.A 105.25,56.5 105.25,59 106.54,60.29 S29.S2
N$30
  Top 0.254: D30.A 86.25,56.5 86.25,58 87.54,59.29 S30.S2
N$31
  Top 0.254: D31.A 67.25,56.5 67.25,59.5 68.54,60.79 S31.S2
N$32
  Top 0.254: D32.A 48.25,56.5 48.25,59.5 49.54,60.79 S32.S2
N$33
  Top 0.254: D33.A 29.25,56.5 29.25,59.5 30.54,60.79 S33.S2
N$34
  Top 0.254: D34.A 10.25,56.5 10.25,59.5 11.54,60.79 S34.S2
N$35
  Top 0.254: D35.A 311.5,37.5 311.5,40 312.79,41.29 312.79,41.42 S35.S2
N$36
  Top 0.254: D36.A 289.75,37.5 289.75,40.5 291.04,41.79 S36.S2
N$37
  Top 0.254: D37.A 270.75,37.5 270.75,40 272.04,41.29 S37.S2
N$38
  Top 0.254: D38.A 251.75,37.5 251.75,40.5 253.04,41.79 S38.S2
N$39
  Top 0.254: D39.A 232.75,37.5 232.75,39.5 234.04,40.79 S39.S2
N$40
  Top 0.254: D40.A 213.75,37.5 213.75,39.5 215.04,40.79 S40.S2
N$41
  Top 0.254: D41.A 194.75,37.5 194.75,39.5 196.04,40.79 S41.S2
N$42
  Top 0.254: D42.A 175.75,37.5 175.75,39.5 177.04,40.79 S42.S2
N$43
  Top 0.254: D43.A 156.75,37.5 156.75,39.5 158.04,40.79 S43.S2
N$44
  Top 0.254: D44.A 137.75,37.5 137.75,40.5 139.04,41.79 S44.S2
N$45
  Top 0.254: D45.A 118.75,37.5 118.75,40.5 120.04,41.79 S45.S2
N$46
  Top 0.254: D46.A 93,37.5 93,40.5 94.29,41.79 S46.S2
N$47
  Top 0.254: D47.A 67.25,37.5 67.25,40.5 68.54,41.79 S47.S2
N$48
  Top 0.254: D48.A 48.25,37.5 48.25,40.5 49.54,41.79 S48.S2
N$49
  Top 0.254: D49.A 29.25,37.5 29.25,40.5 30.54,41.79 S49.S2
N$50
  Top 0.254: D50.A 10.25,37.5 10.25,40.5 11.54,41.79 S50.S2
N$51
  Top 0.254: D51.A 307.5,18.5 307.5,21.5 308.79,22.79 S51.S2
N$52
  Top 0.254: D52.A 281.75,18.5 281.75,21.5 283.04,22.79 S52.S2
N$53
  Top 0.254: D53.A 262.75,18.5 262.75,21.5 264.04,22.79 S53.S2
N$54
  Top 0.254: D54.A 243.75,18.5 243.75,21.5 245.04,22.79 S54.S2
N$55
  Top 0.254: D55.A 224.75,18.5 224.75,21.5 226.04,22.79 S55.S2
N$56
  Top 0.254: D56.A 205.75,18.5 205.75,21.5 207.04,22.79 S56.S2
N$57
  Top 0.254: D57.A 186.75,18.5 186.75,21.5 188.04,22.79 S57.S2
N$58
  Top 0.254: D58.A 167.75,18.5 167.75,21.5 169.04,22.79 S58.S2
N$59
  Top 0.254: D59.A 148.75,18.5 148.75,21.5 150.04,22.79 S59.S2
N$60
  Top 0.254: D60.A 129.75,18.5 129.75,21.5 131.04,22.79 S60.S2
N$61
  Top 0.254: D61.A 108,18.5 108,21.5 109.29,22.79 S61.S2
N$62
  Top 0.254: D62.A 86.25,18.5 86.25,21.5 87.54,22.79 S62.S2
N$63
  Top 0.254: D63.A 67.25,18.5 67.25,21.5 68.54,22.79 S63.S2
N$64
  Top 0.254: D64.A 48.25,18.5 48.25,21.5 49.54,22.79 S64.S2
N$65
  Top 0.254: D65.A 29.25,18.5 29.25,21.5 30.54,22.79 S65.S2
N$66
  Top 0.254: D66.A 10.25,18.5 10.25,21.5 11.54,22.79 S66.S2
N$67
  Top 0.254: D67.A 311.5,18.5 311.5,16 313,14.5 313,3.92 S67.S2
N$68
  Top 0.254: D68.A 289.75,18.5 289.75,16 291.25,14.5 291.25,3.92 S68.S2
N$69
  Top 0.254: D69.A 270.75,18.5 270.75,16 272.25,14.5 272.25,3.92 S69.S2
N$70
  Top 0.254: D70.A 251.75,18.5 251.75,16 253.25,14.5 253.25,3.92 S70.S2
N$71
  Top 0.254: D71.A 229,18.5 229,10 227.5,8.5 227.5,3.92 S71.S2
N$72
  Top 0.254: D72.A 182.25,18.5 182.25,17.75 185.5,14.5 185.5,3.92 S72.S2
N$73
  Top 0.254: D73.A 153,18.5 153,11.25 150.25,8.5 150.25,3.92 S73.S2
N$74
  Top 0.254: D74.A 134,18.5 134,11.25 131.25,8.5 131.25,3.92 S74.S2
N$75
  Top 0.254: D75.A 112.5,18.5 112.5,4.25 112.17,3.92 S75.S2
N$76  (via drill 0.51)
  Top 0.254: v90.5,17 90.5,18.5 D76.A
  Bottom 0.254: v90.5,17 90.5,3.92 S76.S2
N$77
  Top 0.254: D77.A 57.5,18.5 56.75,19.25 54.75,19.25 54.75,17.75 57,15.5 58.25,15.5 59.25,14.5 59.25,3.92 S77.S2
N$78
  Top 0.254: D78.A 33.5,18.5 33.5,11.25 30.75,8.5 30.75,4.31 30.54,4.1 S78.S2
N$79
  Top 0.254: D79.A 14.5,18.5 14.5,11.25 11.75,8.5 11.75,3.92 S79.S2
N$80  (via drill 0.51)
  Top 0.254: v98.75,40.5 98.75,38.75 97,37 97,33.5 R1.2 | v95.75,45.75 95.5,46 95.5,48.5 96.65,49.65 98.73,49.65 ATMEGA32U4-AU.3
  Bottom 0.254: v98.75,40.5 101.5,43.25 101.5,44.25 100,45.75 v95.75,45.75
N$81  (via drill 0.51)
  Top 0.254: v76.5,50.25 76.5,42 83,35.5 86.7,35.5 92.7,29.5 95.25,29.5 96.75,31 R2.2 | v99.5,52.25 100.25,51.5 100.25,49.25 99.75,48.75 98.99,48.75 ATMEGA32U4-AU.4
  Bottom 0.254: v76.5,50.25 77.25,50.25 81.75,54.75 86.25,54.75 87.62,53.38 89.94,53.38 | v99.5,52.25 98.38,53.38 93.56,53.38 | 89.94,53.38 | 93.56,53.38 | 89.94,53.38 93.56,53.38
N$82
  Top 0.254: R1.1 91.75,33.5 83.5,41.75 83.5,50 82,51.5 82,56.1 81.46,56.64 80.63,56.64 80.09,56.1 78.9,56.1 72.5,62.5 72.5,86.75 67.75,91.5 24.25,91.5 23.25,90.5 19.25,90.5 19.25,88 | U$1.A7 18.25,87.75 18.5,88 19.25,88 | U$1.B7 19.25,88
N$84  (via drill 0.51)
  Top 0.254: R2.1 94.14,31 94.14,30.61 92.36,30.61 92.36,31.99 91.49,31.99 86.85,36.63 v83.13,36.63 | U$1.A6 18.75,85.95 18.5,85.7 | U$1.B6 17.75,85.88 17.93,85.7 18.5,85.7 | 18.5,85.7 v18.5,85
  Bottom 0.254: v83.13,36.63 76.89,36.63 76.89,31.93 68.92,31.93 68.67,31.68 63.33,31.68 63.33,36.89 18.5,36.89 18.5,82.35 16.61,84.24 16.61,89.39 18.39,89.39 18.39,85 v18.5,85
N$85  (via drill 0.51)
  Top 0.254: v101.75,39.75 101.75,41.26 ATMEGA32U4-AU.13 | v85.5,44 85.39,44.11 85.39,48.83 82.51,51.71 82.51,56.31 81.67,57.15 79.85,57.15 v76,61 | v58.5,51 55.89,51 S80.3
  Bottom 0.254: v101.75,39.75 99.5,39.75 99.25,39.5 85.25,39.5 82,42.75 78.25,42.75 77.5,43.5 77.5,44.5 78.25,45.25 80,45.25 81.26,46.51 ISP.5 82.99,46.51 v85.5,44 | v76,61 71.39,56.39 71.39,56.13 68.63,53.38 64.19,53.38 61.82,51 v58.5,51
N$86  (via drill 0.51)
  Top 0.254: v107.25,36.25 116.5,27 116.5,26 C3.1 | v104.5,39 104.5,40 104,40.5 104,41.26 ATMEGA32U4-AU.16 | Y1.3 78.67,51.83 80,50.5 80,49 80.75,48.25 v82,48.25 | v84.5,47.25 84.5,42.1 v89.1,37.5
  Bottom 0.254: v107.25,36.25 v104.5,39 103,37.5 v89.1,37.5 | v84.5,47.25 83.5,48.25 v82,48.25
N$87  (via drill 0.51)
  Top 0.254: v119.25,29.75 118,29.75 116.75,28.5 C2.1 | v104.25,49 103.2,49 v100.75,46.55 | ATMEGA32U4-AU.17 104.73,42.77 v104.5,43 | v81,55.75 80,54.75 80,52.5 80.75,51.75 80.75,49.93 Y1.1 | v100,57 101.75,55.25 v101.75,54.25
  Bottom 0.254: v119.25,29.75 119.25,35.25 110.75,43.75 109.25,43.75 105.75,47.25 105.75,47.5 v104.25,49 101.75,51.5 v101.75,54.25 | v104.5,43 104.3,43 v100.75,46.55 | v81,55.75 86.75,55.75 92.5,61.5 95.5,61.5 v100,57
N$88  (via drill 0.51)
  Top 0.254: R3.1 95.15,28.99 95.76,28.99 95.76,29.29 96.69,30.22 97.68,30.22 97.68,31.5 v98.86,31.5 | v94.14,24.88 94.14,25.49 93.49,25.49 92.48,26.5 88.47,26.5 88.26,26.71 88.26,29.26 88.24,29.26 86.45,31.05 81.46,31.05 80.5,32.01 77.49,32.01 75.49,34 75,34 75,41.74 74.99,41.74 74.99,56.5 v70.5,56.5 | v24.15,90.14 24.15,89.76 20.74,89.76 19.76,88.77 U$1.A5 | U$1.A5 19.76,86.81 | U$1.A5 | v50,55 50,51.39 47.98,49.38 42.62,49.38 40.74,47.49 40.74,38.26 43.88,35.11 54.39,35.11 v54.5,35 | v69.5,20 R7.1
  Bottom 0.254: v98.86,31.5 98.86,24.88 v94.14,24.88 | v70.5,56.5 49.03,56.5 | 49.03,56.5 46.14,59.39 46.14,63.62 47.98,63.62 49.38,65.02 49.38,67.18 59.74,67.18 59.74,61.93 60.2,61.47 64.18,61.47 64.18,62.99 79.2,62.99 79.2,61.47 83.18,61.47 83.18,63.62 85.98,63.62 87.38,65.02 87.38,67.61 93.39,67.61 93.39,73.89 40,73.89 39.83,74.06 39.83,76.47 38.46,77.83 36.54,77.83 35.7,77 26.18,77 26.18,82.62 28.98,82.62 30.38,84.02 30.38,85.98 28.98,87.38 24.15,87.38 v24.15,90.14 | 49.03,56.5 50,55.52 v50,55 | v69.5,20 68.47,21.03 67.76,21.03 66.65,22.14 66.65,23.95 61.41,29.18 60.32,29.18 v54.5,35
N$89  (via drill 0.51)
  Top 0.254: R4.1 94,26 88.35,31.65 81.6,31.65 78.5,34.75 v76,34.75 | v17.5,88.5 16.75,87.75 U$1.B5 | v70,33.5 70,29.13 v69.93,29.07 | v70,17 70.5,17.5 R8.1
  Bottom 0.254: 69,34.75 67.53,34.75 18.94,83.34 18.74,83.34 18.49,83.09 17.5,84.07 v17.5,88.5 17.51,88.49 | 69,34.75 v76,34.75 | 69,34.75 70,33.75 v70,33.5 | v70,17 69.93,17.07 69.93,19.18 70.43,19.67 70.43,23.7 69.9,24.24 69.9,28.49 69.93,28.53 v69.93,29.07
N$90  (via drill 0.51)
  Top 0.254: ATMEGA32U4-AU.1 97,52.98 v97,54.5 | v94.5,60.5 96,62 v96,62.5 | v43,77 43,75.5 v38.5,71 | v43.52,60.02 44.15,59.39 45.62,59.39 46.44,58.56 46.44,55.97 40.23,49.75 40.23,38.05 38,35.82 v38,24.5 | v79,16 85.65,22.65 85.65,23.7 86.76,24.81 88.32,24.81 89.64,23.5 R5.1
  Bottom 0.254: v97,54.5 94.5,57 v94.5,60.5 | v96,62.5 96,65.53 97.64,67.17 97.64,70.36 90.5,77.5 43.5,77.5 v43,77 | v38.5,71 40.74,68.76 40.74,63.24 43.52,60.45 v43.52,60.02 | v79,16 69,16 63,22 52.22,22 50.71,20.49 45.48,20.49 41.47,24.5 v38,24.5
N$91  (via drill 0.51)
  Top 0.254: v176.75,37.75 v188.5,49.5 | v94.5,22 95.25,22 96.75,23.5 R5.2
  Bottom 0.254: v188.5,49.5 299.25,49.5 300.5,48.25 300.5,47.25 299.5,46.25 D80.A | v176.75,37.75 167.75,37.75 147.5,17.5 96.75,17.5 94,20.25 94,21.5 v94.5,22
N$92  (via drill 0.51)
  Top 0.254: ATMEGA32U4-AU.6 99.24,47.25 99.97,47.25 102.24,49.52 v102.47,49.52 | v125.8,22 127.3,23.5 127.3,25.84 125.94,27.21 125.94,33.62 127.3,34.98 v127.3,55.4 | v118.6,20.7 116.65,22.65 C4.1
  Bottom 0.254: v102.47,49.52 102.47,50.06 100.86,51.67 100.86,54.62 101.38,55.14 102.12,55.14 102.76,54.5 103.24,54.5 103.62,54.12 | 103.63,54.11 103.62,54.12 | 103.62,54.12 103.81,54.31 104.37,54.31 104.89,54.83 104.89,55.39 105.2,55.7 107.49,55.7 109.8,58.01 124.69,58.01 v127.3,55.4 | v125.8,22 119.9,22 v118.6,20.7
N$93  (via drill 0.51)
  Top 0.254: ATMEGA32U4-AU.33 110.47,51.46 111.39,52.38 111.39,58.99 v113,60.6 | v128.6,52 128.6,38.4 v133,34 | v104.2,22.9 97.3,16 v83.5,16 | v71.9,23.7 73.1,22.5 R6.1
  Bottom 0.254: v113,60.6 115.08,58.52 132.26,58.52 135.13,61.39 135.87,61.39 136.39,60.87 136.39,60.13 128.6,52.34 v128.6,52 | v133,34 130.88,31.88 130.88,28.98 133.62,26.24 138.99,26.24 141.93,29.18 142.91,29.18 145.58,26.51 145.58,24.68 144.47,23.57 142.91,23.57 141.58,24.89 126.8,24.89 124.81,22.9 111.95,22.9 110.07,21.03 108.51,21.03 106.63,22.9 v104.2,22.9 | v83.5,16 75.8,23.7 v71.9,23.7
R1  (via drill 0.51)
  Top 0.254: S17.S1 5.23,82.5 24.15,82.5 S16.S1 24.35,82.3 43.03,82.3 S15.S1 43.23,82.5 62.15,82.5 S14.S1 | S1.S1 309.15,82.5 290.23,82.5 S2.S1 290.15,82.5 271.23,82.5 S3.S1 271.05,82.6 252.33,82.6 S4.S1 252.03,82.3 233.35,82.3 S5.S1 233.05,82.6 214.33,82.6 S6.S1 214.13,82.4 195.25,82.4 S7.S1 195.15,82.5 176.23,82.5 S8.S1 176.03,82.3 157.35,82.3 S9.S1 157.15,82.5 138.23,82.5 S10.S1 138.03,82.3 119.35,82.3 S11.S1 119.05,82.6 100.33,82.6 S12.S1 S13.S1 | v102.75,62.25 101.75,61.25 101.75,56.25 103,55 103,52.74 ATMEGA32U4-AU.41
  Bottom 0.254: v102.75,62.25 102.75,63.75 100.25,66.25 100.25,82.4 S12.S1 | S13.S1 81.13,82.4 62.25,82.4 S14.S1
R2  (via drill 0.51)
  Top 0.254: S34.S1 5.23,63.5 24.15,63.5 S33.S1 24.25,63.4 43.13,63.4 S32.S1 43.25,63.4 62.13,63.4 S31.S1 | v104,55.2 104,52.74 ATMEGA32U4-AU.40 | S30.S1 S29.S1 | S22.S1 233.13,63.4 214.25,63.4 S23.S1 214.13,63.4 195.25,63.4 S24.S1 | S25.S1 176.13,63.4 157.25,63.4 S26.S1 157.13,63.4 138.25,63.4 S27.S1
  Bottom 0.254: v104,55.2 104,59.5 103,60.5 | S29.S1 100.19,63.21 102.95,60.45 103,60.5 | S27.S1 138.15,63.5 119.23,63.5 S28.S1 118.99,63.46 118.78,63.25 105.75,63.25 103.05,60.55 103,60.5 | S18.S1 309.13,63.4 290.25,63.4 S19.S1 290.05,63.6 271.33,63.6 S20.S1 271.13,63.4 252.25,63.4 S21.S1 252.13,63.4 233.25,63.4 S22.S1 | S24.S1 195.13,63.4 176.25,63.4 S25.S1 | S30.S1 81.05,63.6 62.33,63.6 S31.S1
R3  (via drill 0.51)
  Top 0.254: S49.S1 S50.S1 | S47.S1 S48.S1 | v82,60 84.5,57.5 84.5,56 84,55.5 84,51.75 88,47.75 88,44.5 87.98,44.5 S46.S1 | v107,47.5 107,50 106.25,50.75 106,50.75 104.73,52.02 ATMEGA32U4-AU.39 | S43.S1 132.61,44.46 S44.S1 | v95.25,68.25 96.25,69.25 107.75,69.25 110.5,66.5 v110.5,52.75
  Bottom 0.254: S47.S1 62.19,46.69 65,49.5 66.75,49.5 77.25,60 v82,60 83.75,60 88.5,64.75 91.75,64.75 v95.25,68.25 | S48.S1 S49.S1 | S35.S1 306.4,44.5 284.73,44.5 S36.S1 284.63,44.4 265.75,44.4 S37.S1 265.49,44.46 265.43,44.4 246.75,44.4 S38.S1 246.65,44.5 227.73,44.5 S39.S1 227.63,44.4 208.75,44.4 S40.S1 208.65,44.5 189.73,44.5 S41.S1 189.63,44.4 170.75,44.4 S42.S1 170.65,44.5 151.73,44.5 S43.S1 | v110.5,52.75 107,49.25 v107,47.5 107.75,46.75 107.75,46.5 109.65,44.6 113.55,44.6 S45.S1 113.75,44.4 132.63,44.4 S44.S1
R4  (via drill 0.51)
  Top 0.254: v108.25,48.25 107.75,48.75 107.75,50 106.25,51.5 106,51.5 105.75,51.75 105.75,52.74 ATMEGA32U4-AU.38 | v123.5,51.25 123.5,48.95 124.85,47.6 124.85,25.82 124.69,25.66 S60.S1 | S56.S1 S55.S1 | v92.5,18.75 96.75,18.75 102.94,24.94 S61.S1 | S58.S1 162.23,25 144.15,25 S59.S1 | S62.S1 80.73,25 62.65,25 S63.S1
  Bottom 0.254: S66.S1 S65.S1 S64.S1 43.15,25.42 43.15,23.6 45.75,21 50.5,21 54.75,25.25 62.19,25.25 S63.S1 | S55.S1 219.69,25.6 238.55,25.6 S54.S1 238.85,25.3 257.69,25.3 S53.S1 257.73,25.5 276.65,25.5 S52.S1 276.75,25.4 302.38,25.4 S51.S1 | v108.25,48.25 109.5,48.25 114.75,53.5 121.25,53.5 v123.5,51.25 | S61.S1 102.94,25.6 124.55,25.6 S60.S1 124.75,25.4 143.63,25.4 S59.S1 | S58.S1 162.83,25.6 181.69,25.6 S57.S1 181.85,25.3 200.53,25.3 S56.S1 | v92.5,18.75 89,18.75 82.5,25.25 81.19,25.25 S62.S1
R5  (via drill 0.51)
  Top 0.254: S76.S1 83.98,6.5 105.65,6.5 S75.S1 | v107.1,54.25 106.5,53.65 106.5,52.74 ATMEGA32U4-AU.37 | v117.25,55.75 118.75,57.25 122.25,57.25 122.5,57 122.5,49 124,47.5 124,30.5 122,28.5 122,12.25 125.05,9.2 125.05,6.46 S74.S1
  Bottom 0.254: v107.1,54.25 114,54.25 115.5,55.75 v117.25,55.75 | S76.S1 83.9,6.5 52.73,6.5 S77.S1 52.51,6.46 52.45,6.4 24.25,6.4 S78.S1 24.13,6.4 5.25,6.4 S79.S1 | S75.S1 105.75,6.4 124.63,6.4 S74.S1 124.75,6.4 143.63,6.4 S73.S1 143.73,6.5 178.9,6.5 S72.S1 179.1,6.3 220.88,6.3 220.94,6.36 S71.S1 220.98,6.5 246.65,6.5 S70.S1 246.85,6.3 265.53,6.3 S69.S1 265.73,6.5 284.65,6.5 S68.S1 284.75,6.4 306.38,6.4 S67.S1
VCC  (via drill 0.51)
  Top 0.254: v109.5,35.5 112,35.5 116.5,31 C1.1 116.75,31 117.75,32 119.5,32 123.25,35.75 123.25,41.5 121.25,43.5 121.25,47.5 121.75,48 121.75,52 119.25,54.5 v119.25,55.25 | v103.25,39.75 102.5,40.5 102.5,41.26 ATMEGA32U4-AU.14 102.44,41.36 102.44,43.56 100.75,45.25 | ATMEGA32U4-AU.34 108.75,52.74 108.75,54.35 v109.6,55.2 109.6,63.65 106.25,67 106.25,67.25 105,68.5 97,68.5 v96.75,68.25 | 100.75,45.25 103.5,48 104.5,48 105,47.5 105,47.25 108.25,44 110.47,44 ATMEGA32U4-AU.24 | 20.75,86.91 20.75,85.89 18.48,83.62 16.08,86.02 16.08,86.87 U$1.A9B4VBUS | ATMEGA32U4-AU.44 100.51,52.74 100,53.25 100,53.5 | 100,53.5 100,54.75 95.5,59.25 92.25,59.25 | 92.25,59.25 92,59.25 v85,52.25 | 20.75,86.91 20.75,88 20.5,88.25 20.5,88.5 21.25,89.25 25.5,89.25 26.5,88.25 66.25,88.25 70,84.5 70,81.25 70.5,80.75 70.5,67.25 69.75,66.5 69.75,63.25 77.5,55.5 77.5,43.25 78.85,41.9 ISP.2 | 20.75,86.91 U$1.A4B9VBUS | 92.25,59.25 v92.25,62.5 | ATMEGA32U4-AU.2 95.05,50.2 95.05,53.42 93.96,54.51 89.01,54.51 89.01,54.79 92.11,57.89 95.39,57.89 98.11,55.17 98.11,53.88 98.63,53.36 99.86,53.36 100,53.5 | v74,35.64 74.49,35.15 74.49,33.79 77.64,30.64 80.37,30.64 81.1,29.9 81.1,28.49 83.08,26.51 83.08,22.07 81.92,22.07 | 81.92,22.07 77.35,17.5 R8.2 | R7.2 77.92,22.07 81.92,22.07 | ATMEGA32U4-AU.7 99.79,46.21 100.75,45.25
  Bottom 0.254: v109.5,35.5 105,40 103.5,40 v103.25,39.75 | v109.6,55.2 114.2,55.2 115.75,56.75 117.75,56.75 v119.25,55.25 | v85,52.25 82.75,52.25 76.75,46.25 76.75,43.1 78.42,41.43 ISP.2 74,36.58 v74,35.64 | v96.75,68.25 96.75,67 v92.25,62.5

## Text on the board
tPlace: New | Resistor_Land
tNames: C:/Users/tankh/Pictures/ShelbyTech.bmp | C:/Users/tankh/Pictures/ShelbyTech.bmp | GND | RST | MOSI | SCK | VCC | MISO | Resistor_Land | Capacitor_Land | Thanks for the help!! | AForland
tValues: RES